# Altium schematic sheet Lattice_ECP5_power.SchDoc: <title>
size C; Organization: Custom Embedded Solutions, LLC.; Address1: 130 Oakland Trace; Address2: Madison, AL 35758; DocumentNumber: <doc_num>; Revision: <Rev>; SheetNumber: 3; SheetTotal: 8; PageTitle: FPGA Power
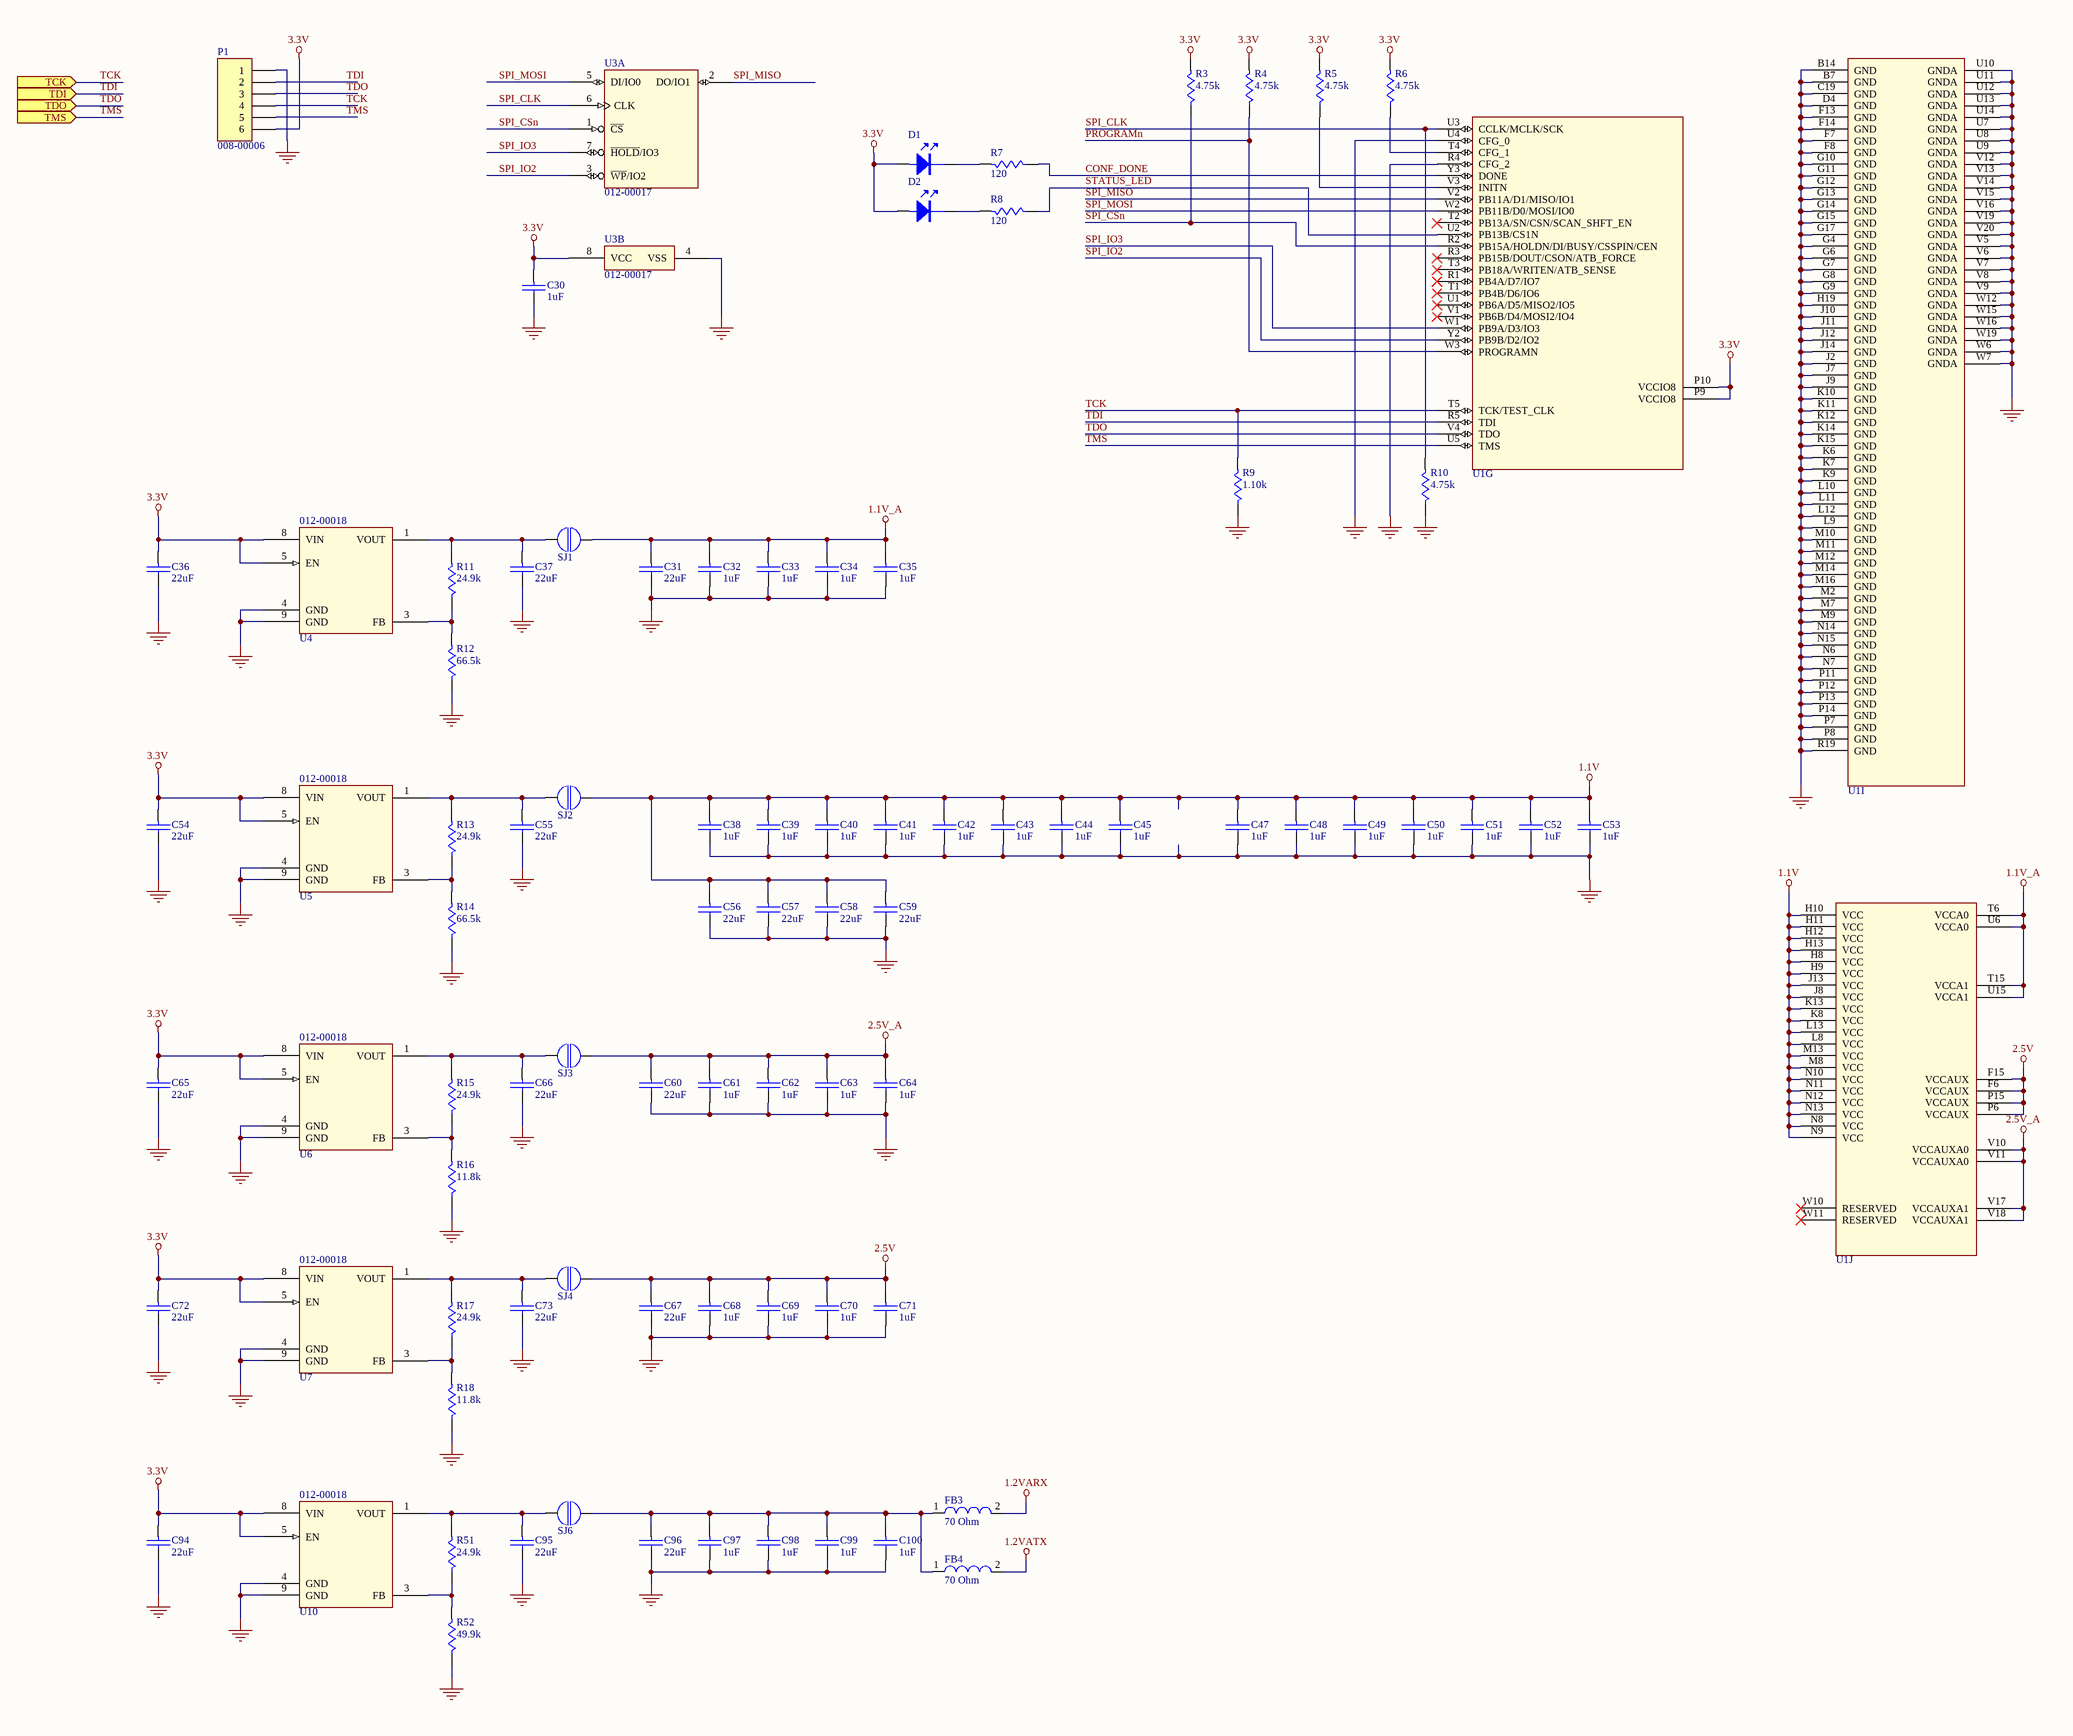
[diagram p0: Lattice_ECP5_power.SchDoc]

## Parts
C30  1uF  [005-00008]
C31  22uF  [005-00003]
C32  1uF  [005-00008]
C33  1uF  [005-00008]
C34  1uF  [005-00008]
C35  1uF  [005-00008]
C36  22uF  [005-00003]
C37  22uF  [005-00003]
C38  1uF  [005-00008]
C39  1uF  [005-00008]
C40  1uF  [005-00008]
C41  1uF  [005-00008]
C42  1uF  [005-00008]
C43  1uF  [005-00008]
C44  1uF  [005-00008]
C45  1uF  [005-00008]
C47  1uF  [005-00008]
C48  1uF  [005-00008]
C49  1uF  [005-00008]
C50  1uF  [005-00008]
C51  1uF  [005-00008]
C52  1uF  [005-00008]
C53  1uF  [005-00008]
C54  22uF  [005-00003]
C55  22uF  [005-00003]
C56  22uF  [005-00003]
C57  22uF  [005-00003]
C58  22uF  [005-00003]
C59  22uF  [005-00003]
C60  22uF  [005-00003]
C61  1uF  [005-00008]
C62  1uF  [005-00008]
C63  1uF  [005-00008]
C64  1uF  [005-00008]
C65  22uF  [005-00003]
C66  22uF  [005-00003]
C67  22uF  [005-00003]
C68  1uF  [005-00008]
C69  1uF  [005-00008]
C70  1uF  [005-00008]
C71  1uF  [005-00008]
C72  22uF  [005-00003]
C73  22uF  [005-00003]
C94  22uF  [005-00003]
C95  22uF  [005-00003]
C96  22uF  [005-00003]
C97  1uF  [005-00008]
C98  1uF  [005-00008]
C99  1uF  [005-00008]
C100  1uF  [005-00008]
D1  (no value)  [005-00018]
D2  (no value)  [005-00018]
FB3  70 Ohm  [005-00010]
FB4  70 Ohm  [005-00010]
P1  Part Number: 008-00006  [005-00023]
R3  4.75k  [005-00009]
R4  4.75k  [005-00009]
R5  4.75k  [005-00009]
R6  4.75k  [005-00009]
R7  120  [005-00009]
R8  120  [005-00009]
R9  1.10k  [005-00009]
R10  4.75k  [005-00009]
R11  24.9k  [005-00009]
R12  66.5k  [005-00009]
R13  24.9k  [005-00009]
R14  66.5k  [005-00009]
R15  24.9k  [005-00009]
R16  11.8k  [005-00009]
R17  24.9k  [005-00009]
R18  11.8k  [005-00009]
R51  24.9k  [005-00009]
R52  49.9k  [005-00009]
SJ1  004-00013  [005-00015]  (value not drawn)
SJ2  004-00013  [005-00015]  (value not drawn)
SJ3  004-00013  [005-00015]  (value not drawn)
SJ4  004-00013  [005-00015]  (value not drawn)
SJ6  004-00013  [005-00015]  (value not drawn)
U1  004-00015  [005-00017]  (value not drawn)  (parts G,I,J of 10)
U3  Part Number: 012-00017  [005-00022]  (hidden comment: 004-00020)  (parts A,B of 2)
U4  Part Number: 012-00018  [005-00011]  (hidden comment: AP7361-FGE-7)
U5  Part Number: 012-00018  [005-00011]  (hidden comment: AP7361-FGE-7)
U6  Part Number: 012-00018  [005-00011]  (hidden comment: AP7361-FGE-7)
U7  Part Number: 012-00018  [005-00011]  (hidden comment: AP7361-FGE-7)
U10  Part Number: 012-00018  [005-00011]  (hidden comment: AP7361-FGE-7)

## Ports
TCK (in), TDI (in), TDO (in), TMS (in)

## Nets
1.1V: C38.1 C39.1 C40.1 C41.1 C42.1 C43.1 C44.1 C45.1 C47.1 C48.1 C49.1 C50.1 C51.1 C52.1 C53.1 C56.1 C57.1 C58.1 C59.1 SJ2.2 U1.H8(VCC) U1.H9(VCC) U1.H10(VCC) U1.H11(VCC) U1.H12(VCC) U1.H13(VCC) U1.J8(VCC) U1.J13(VCC) U1.K8(VCC) U1.K13(VCC) U1.L8(VCC) U1.L13(VCC) U1.M8(VCC) U1.M13(VCC) U1.N8(VCC) U1.N9(VCC) U1.N10(VCC) U1.N11(VCC) U1.N12(VCC) U1.N13(VCC)
1.1V_A: C31.1 C32.1 C33.1 C34.1 C35.1 SJ1.2 U1.T6(VCCA0) U1.T15(VCCA1) U1.U6(VCCA0) U1.U15(VCCA1)
1.2VARX: FB3.2
1.2VATX: FB4.2
2.5V: C67.1 C68.1 C69.1 C70.1 C71.1 SJ4.2 U1.F6(VCCAUX) U1.F15(VCCAUX) U1.P6(VCCAUX) U1.P15(VCCAUX)
2.5V_A: C60.1 C61.1 C62.1 C63.1 C64.1 SJ3.2 U1.V10(VCCAUXA0) U1.V11(VCCAUXA0) U1.V17(VCCAUXA1) U1.V18(VCCAUXA1)
3.3V: C30.1 C36.1 C54.1 C65.1 C72.1 C94.1 D1.ANODE D2.ANODE P1.6 R3.1 R4.1 R5.1 R6.1 U1.P9(VCCIO8) U1.P10(VCCIO8) U3.8(VCC) U4.5(EN) U4.8(VIN) U5.5(EN) U5.8(VIN) U6.5(EN) U6.8(VIN) U7.5(EN) U7.8(VIN) U10.5(EN) U10.8(VIN)
GND: C30.2 C31.2 C32.2 C33.2 C34.2 C35.2 C36.2 C37.2 C38.2 C39.2 C40.2 C41.2 C42.2 C43.2 C44.2 C45.2 C47.2 C48.2 C49.2 C50.2 C51.2 C52.2 C53.2 C54.2 C55.2 C56.2 C57.2 C58.2 C59.2 C60.2 C61.2 C62.2 C63.2 C64.2 C65.2 C66.2 C67.2 C68.2 C69.2 C70.2 C71.2 C72.2 C73.2 C94.2 C95.2 C96.2 C97.2 C98.2 C99.2 C100.2 P1.1 R9.2 R10.2 R12.2 R14.2 R16.2 R18.2 R52.2 U1.B7(GND) U1.B14(GND) U1.C19(GND) U1.D4(GND) U1.F7(GND) U1.F8(GND) U1.F13(GND) U1.F14(GND) U1.G4(GND) U1.G6(GND) U1.G7(GND) U1.G8(GND) U1.G9(GND) U1.G10(GND) U1.G11(GND) U1.G12(GND) U1.G13(GND) U1.G14(GND) U1.G15(GND) U1.G17(GND) U1.H19(GND) U1.J2(GND) U1.J7(GND) U1.J9(GND) U1.J10(GND) U1.J11(GND) U1.J12(GND) U1.J14(GND) U1.K6(GND) U1.K7(GND) U1.K9(GND) U1.K10(GND) U1.K11(GND) U1.K12(GND) U1.K14(GND) U1.K15(GND) U1.L9(GND) U1.L10(GND) U1.L11(GND) U1.L12(GND) U1.M2(GND) U1.M7(GND) U1.M9(GND) U1.M10(GND) U1.M11(GND) U1.M12(GND) U1.M14(GND) U1.M16(GND) U1.N6(GND) U1.N7(GND) U1.N14(GND) U1.N15(GND) U1.P7(GND) U1.P8(GND) U1.P11(GND) U1.P12(GND) U1.P13(GND) U1.P14(GND) U1.R4(CFG_2) U1.R19(GND) U1.U4(CFG_0) U1.U7(GNDA) U1.U8(GNDA) U1.U9(GNDA) U1.U10(GNDA) U1.U11(GNDA) U1.U12(GNDA) U1.U13(GNDA) U1.U14(GNDA) U1.V5(GNDA) U1.V6(GNDA) U1.V7(GNDA) U1.V8(GNDA) U1.V9(GNDA) U1.V12(GNDA) U1.V13(GNDA) U1.V14(GNDA) U1.V15(GNDA) U1.V16(GNDA) U1.V19(GNDA) U1.V20(GNDA) U1.W6(GNDA) U1.W7(GNDA) U1.W12(GNDA) U1.W15(GNDA) U1.W16(GNDA) U1.W19(GNDA) U3.4(VSS) U4.4(GND) U4.9(GND) U5.4(GND) U5.9(GND) U6.4(GND) U6.9(GND) U7.4(GND) U7.9(GND) U10.4(GND) U10.9(GND)
CONF_DONE: R7.2 U1.Y3(DONE)
PROGRAMn: R4.2 U1.W3(PROGRAMN)
SPI_CLK: R10.1 U1.U3(CCLK/MCLK/SCK) U3.6(CLK)
SPI_CSn: R3.2 U1.R2(PB15A/HOLDN/DI/BUSY/CSSPIN/CEN) U3.1(~{CS})
SPI_IO2: U1.Y2(PB9B/D2/IO2) U3.3(~{WP}/IO2)
SPI_IO3: U1.W1(PB9A/D3/IO3) U3.7(~{HOLD}/IO3)
SPI_MISO: U1.V2(PB11A/D1/MISO/IO1) U3.2(DO/IO1)
SPI_MOSI: U1.W2(PB11B/D0/MOSI/IO0) U3.5(DI/IO0)
STATUS_LED: R8.2 U1.U2(PB13B/CS1N)
TCK: P1.4 R9.1 U1.T5(TCK/TEST_CLK) ; port TCK
TDI: P1.2 U1.R5(TDI) ; port TDI
TDO: P1.3 U1.V4(TDO) ; port TDO
TMS: P1.5 U1.U5(TMS) ; port TMS
NetC37_1: C37.1 R11.1 SJ1.1 U4.1(VOUT)
NetC55_1: C55.1 R13.1 SJ2.1 U5.1(VOUT)
NetC66_1: C66.1 R15.1 SJ3.1 U6.1(VOUT)
NetC73_1: C73.1 R17.1 SJ4.1 U7.1(VOUT)
NetC95_1: C95.1 R51.1 SJ6.1 U10.1(VOUT)
NetC96_1: C96.1 C97.1 C98.1 C99.1 C100.1 FB3.1 FB4.1 SJ6.2
NetD1_CATHODE: D1.CATHODE R7.1
NetD2_CATHODE: D2.CATHODE R8.1
NetR5_2: R5.2 U1.V3(INITN)
NetR6_2: R6.2 U1.T4(CFG_1)
NetR11_2: R11.2 R12.1 U4.3(FB)
NetR13_2: R13.2 R14.1 U5.3(FB)
NetR15_2: R15.2 R16.1 U6.3(FB)
NetR17_2: R17.2 R18.1 U7.3(FB)
NetR51_2: R51.2 R52.1 U10.3(FB)

Not connected (* = marked no-connect by the designer): U1 R1(PB4A/D7/IO7)* R3(PB15B/DOUT/CSON/ATB_FORCE)* T1(PB4B/D6/IO6)* T2(PB13A/SN/CSN/SCAN_SHFT_EN)* T3(PB18A/WRITEN/ATB_SENSE)* U1(PB6A/D5/MISO2/IO5)* V1(PB6B/D4/MOSI2/IO4)* W10(RESERVED)* W11(RESERVED)*; U4 2(NC) 6(NC) 7(NC); U5 2(NC) 6(NC) 7(NC); U6 2(NC) 6(NC) 7(NC); U7 2(NC) 6(NC) 7(NC); U10 2(NC) 6(NC) 7(NC)

## Notes on the sheet
- Copyright (c)
- Page Title
- Design Title
- Creative Commons License, http://creativecommons.org/licenses/by/4.0/legalcode
  This PCB design by Custom Embedded Solutions, LLC. is licensed under a Creative Commons Attribution 4.0 International License.
- Size:
- Date:
- File:
- C
- Document Number:
- Time:
- Sheet
- Rev:
- of

## Library data of the parts
C30 = 011-00017: CAP CER 1UF 6.3V 10% X5R 0402; Manufacturer1 Part Number: CL05A105KQ5NNNC; Manufacturer1: Samsung; Type: Ceramic; Types: Y1; Part Number: 011-00017; Voltage: 6.3V; Substrate: X5R; Value: 1uF; Package: 1005, EIA 0402, Chip Capacitor, 2-Leads, Body 1.00x0.50mm, IPC High Density
C31 C36 C37 C54-C60 C65-C67 C72 C73 C94-C96 = 011-00004: CAP CER 22UF 6.3V X5R 20% 0805; Manufacturer1 Part Number: C2012X5R0J226M/1.25; Manufacturer1: TDK; Manufacturer2 Part Number: CL21A226KQQNNNF; Manufacturer3 Part Number: 08056D226MAT2A; 3rd Party: {Reference Design}; Type: Ceramic; Part Number: 011-00004; Voltage: 6.3V; Substrate: X5R; Manufacturer2: Samsung; Manufacturer3: AVX; Value: 22uF; Package: 2012, EIA 0805, Chip Capacitor, 2-Leads, Body 2.00x1.25mm, IPC High Density
C32-C35 C38-C45 C47-C53 C61-C64 C68-C71 C97-C100 = 011-00017: CAP CER 1UF 6.3V 10% X5R 0402; Manufacturer1 Part Number: CL05A105KQ5NNNC; Manufacturer1: Samsung; Types: Y1; Type: Ceramic; Part Number: 011-00017; Substrate: X5R; Voltage: 6.3V; Value: 1uF; Package: 1005, EIA 0402, Chip Capacitor, 2-Leads, Body 1.00x0.50mm, IPC High Density
D1 D2 = 013-00003: LED Green SMD 20mA 2.2V 0603; Manufacturer1: Osram; Manufacturer1 Part Number: LG Q971-KN-1; Types: PNP; Preferred: Yes; Part Number: 013-00003; Current: 20mA; Voltage: 2.2V; Type: LED; Package: 0603, LED
FB3 FB4 = 010-00004: FERRITE CHIP 70 OHM 4000MA 0603; Manufacturer1: Samsung; Manufacturer1 Part Number: CIS10P700AC; Types: Signal Transformer; Current: 4A; DCR: 20mOhm; Preferred: Yes; Part Number: 010-00004; Type: Ferrite; Value: 70 Ohm; Package: 1608, EIA 0603, Chip Inductor, 2-Leads, Body 1.60x0.80mm, IPC High Density
P1 = 008-00006: Connector, plug of nails, 6pin, no legs; Package: Tag-Connect 6 position (NL)
R3-R6 R10 = 009-00001: RES 4.75K OHM 1/16W 1% 0402 SMD; Manufacturer1 Part Number: RMCF0402FT4K75; Manufacturer1: Stackpole Electronics; 3rd Party: {Reference Design}; Tolerance: 0.01; Types: Metal Film; Part Number: 009-00001; Power: 1/16W; Value: 4.75k; Package: 1005, EIA 0402, Chip Resistor, 2-Leads, Body 1.00x0.50mm, IPC High Density
R7 R8 = 009-00021: RES 120 OHM 1/16W 5% 0402; Manufacturer1 Part Number: RMCF0402JT120R; Manufacturer1: Stackpole Electronics; Tolerance: 0.05; Part Number: 009-00021; Power: 1/16W; Value: 120; Package: 1005, EIA 0402, Chip Resistor, 2-Leads, Body 1.00x0.50mm, IPC High Density
R9 = 009-00008: RES 1.10K OHM 1/16W 1% 0402 SMD; Manufacturer1 Part Number: RC0402FR-071K1L; Manufacturer1: Yageo; 3rd Party: {Reference Design}; Tolerance: 0.01; Part Number: 009-00008; Power: 1/16W; Value: 1.10k; Package: 1005, EIA 0402, Chip Resistor, 2-Leads, Body 1.00x0.50mm, IPC High Density
R11 R13 R15 R17 R51 = 009-00024: RES 24.9K OHM 1/10W 1% 0402 SMD; Manufacturer1 Part Number: ERJ-2RKF2492X; Manufacturer1: Panasonic; Tolerance: 0.01; Power: 1/16W; Part Number: 009-00024; Value: 24.9k; Package: 1005, EIA 0402, Chip Resistor, 2-Leads, Body 1.00x0.50mm, IPC High Density
R12 R14 = 009-00026: RES 66.5K OHM 1/10W 1% 0402 SMD; Manufacturer1 Part Number: ERJ-2RKF6652X; Manufacturer1: Panasonic; Tolerance: 0.01; Power: 1/16W; Part Number: 009-00026; Value: 66.5k; Package: 1005, EIA 0402, Chip Resistor, 2-Leads, Body 1.00x0.50mm, IPC High Density
R16 R18 = 009-00025: RES 11.8K OHM 1/10W 1% 0402 SMD; Manufacturer1 Part Number: ERJ-2RKF1182X; Manufacturer1: Panasonic; Tolerance: 0.01; Power: 1/16W; Part Number: 009-00025; Value: 11.8k; Package: 1005, EIA 0402, Chip Resistor, 2-Leads, Body 1.00x0.50mm, IPC High Density
R52 = 009-00031: RES 49.9K OHM 1/10W 1% 0402 SMD; Manufacturer1 Part Number: ERJ-2RKF4992X; Manufacturer1: Panasonic; Tolerance: 0.01; Power: 1/16W; Part Number: 009-00031; Value: 49.9k; Package: 1005, EIA 0402, Chip Resistor, 2-Leads, Body 1.00x0.50mm, IPC High Density
SJ1-SJ4 SJ6 = 008-00009: Solder Jumper, 50mil; Part Number: 008-00009; Package: Solder Jumper, 25x55mil
U1 = 012-00019: IC FPGA 4/203 I/O 381caBGA; Manufacturer1: Lattice; Manufacturer1 Part Number: LFE5UM-45F-6BG381C; SWAP_INFO: (S1+S2+S3+S4+S5+S6+S7+S8+S9+S10); SPLIT_INST: TRUE; Part Number: 012-00019; Type: Embedded (uP/PLD); Package: CABGA 381 8x14x1.2mm 17.0x17.0mm 0.8mm pitch
U3 = 012-00017: IC FLASH 32MBIT 104MHZ 8SO; Manufacturer1 Part Number: S25FL032P0XMFI011; Manufacturer1: Spansion; Type: Memory; Package: SOIC, 8-Leads, Body 5.4x5.4mm
U4-U7 U10 = 012-00018: IC REG LDO ADJ 1A 8DFN; Manufacturer1: Diodes Inc; Preferred: Yes; Manufacturer1 Part Number: AP7361-FGE-7; Type: PMIC; Value: AP7361-FGE-7; Package: QFN, 8-Leads, Body 3.0x3.0mm (max), Pitch 0.65mm, IPC Medium Density